# Altium project CM4_Home_Controller.PrjPcb (part 2 of 2)

## Sheet USB.SchDoc
size A4; SheetNumber: 6; SheetTotal: 10
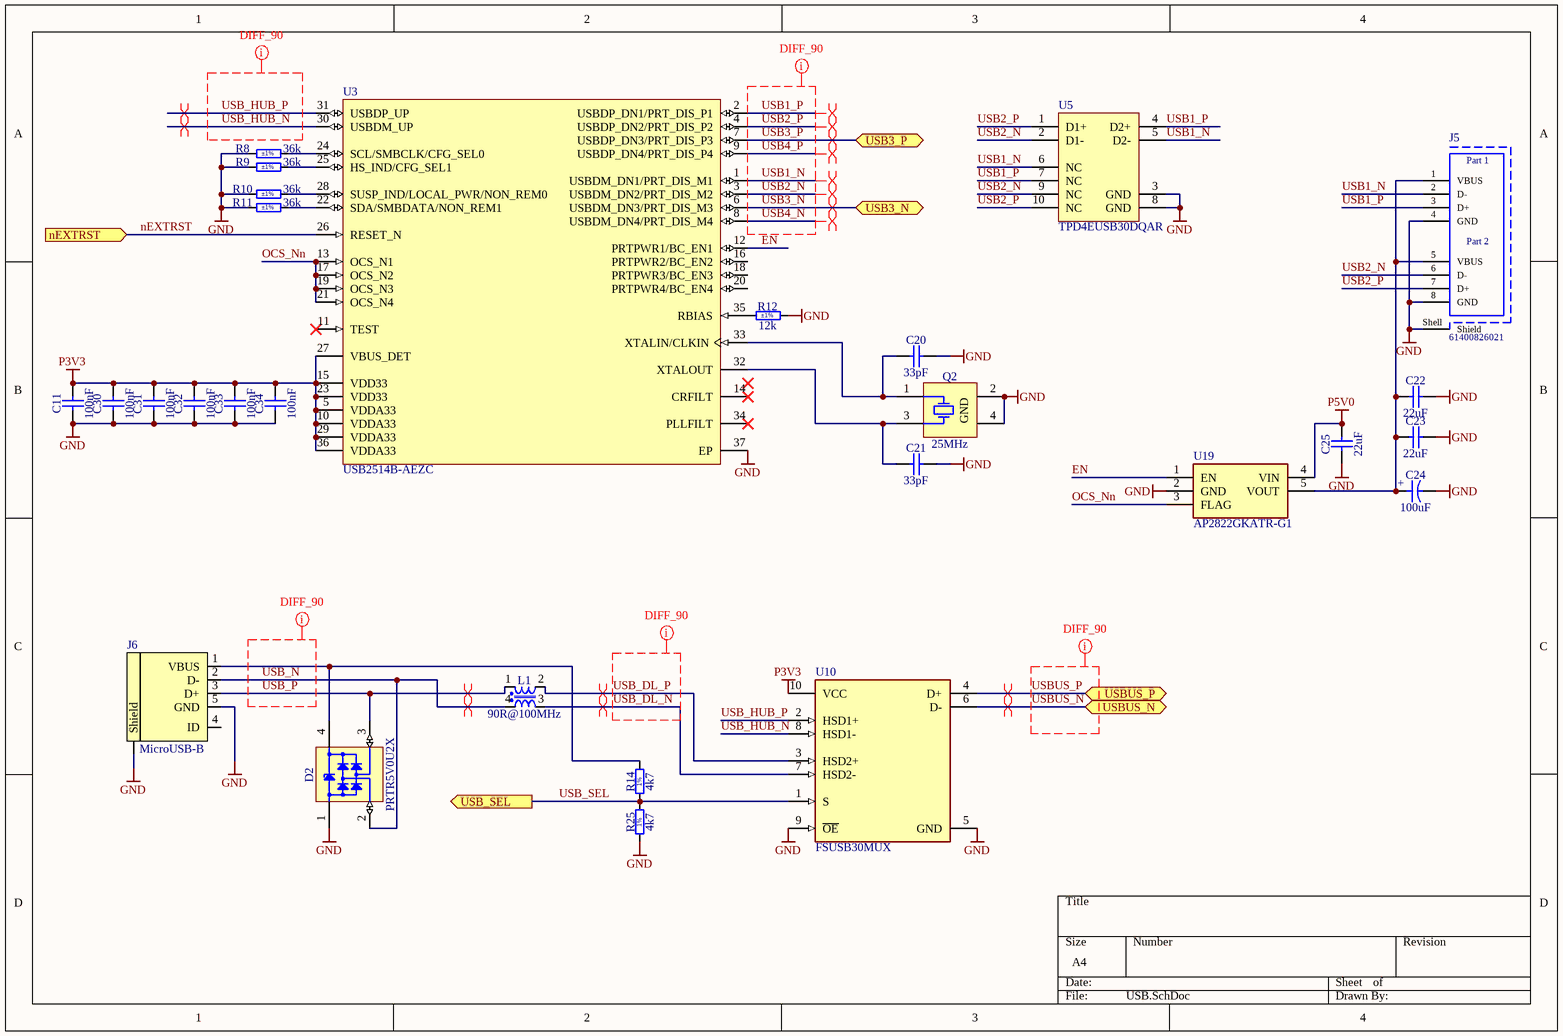
[diagram p5: USB.SchDoc]

### Parts
C11  100nF  [CAPC1005X55N]
C20  33pF  [CAPC1005X55N]
C21  33pF  [CAPC1005X55N]
C22  22uF  [CAPC2012X135N]
C23  22uF  [CAPC2012X135N]
C24  100uF  [CAPMP3216X180N]
C25  22uF  [CAPC2012X135N]
C30  100nF  [CAPC1005X55N]
C31  100nF  [CAPC1005X55N]
C32  100nF  [CAPC1005X55N]
C33  100nF  [CAPC1005X55N]
C34  100nF  [CAPC1005X55N]
D2  PRTR5V0U2X  [SOT190P230X110-4N]
J5  61400826021  [61400826021]
J6  MicroUSB-B  [USB-Micro-B-RA-SMD-PiP]
L1  90R@100MHz  [IND_MURATA_DLW21S]
Q2  25MHz  [XTAL_EPSON_TSX-3225]
R8  36k  Tolerance: ±1%  [RESC1005X40N]
R9  36k  Tolerance: ±1%  [RESC1005X40N]
R10  36k  Tolerance: ±1%  [RESC1005X40N]
R11  36k  Tolerance: ±1%  [RESC1005X40N]
R12  12k  Tolerance: ±1%  [RESC1005X40N]
R14  4k7  [RESC1005X40N]
R25  4k7  [RESC1005X40N]
U3  USB2514B-AEZC  [MCHP-QFN-36_V]
U5  TPD4EUSB30DQAR  [DQA0010A_V]
U10  FSUSB30MUX  [FP-846AP-IPC_C]
U19  AP2822GKATR-G1  [SOT95P282X145-5N]

### Ports
nEXTRST (in), USB3_N (bidir), USB3_P (bidir), USB_SEL (out), USBUS_N (bidir), USBUS_P (bidir)

### Nets
GND: C11.1 C20.2 C21.2 C22.2 C23.2 C24.2 C25.1 C30.1 C31.1 C32.1 C33.1 C34.1 D2.1(GND) J5.4(GND) J5.8(GND) J5.Shell(Shield) J6.5(GND) J6.6(Shield) Q2.2(GND) Q2.4(GND) R8.1 R9.1 R10.1 R11.1 R12.2 R25.1 U3.37(EP) U5.3(GND) U5.8(GND) U10.5(GND) U10.9(~{OE}) U19.2(GND)
P3V3: C11.2 C30.2 C31.2 C32.2 C33.2 C34.2 U3.5(VDDA33) U3.10(VDDA33) U3.15(VDD33) U3.23(VDD33) U3.27(VBUS_DET) U3.29(VDDA33) U3.36(VDDA33) U10.10(VCC)
P5V0: C25.2 U19.4(VIN)
EN: U3.12(PRTPWR1/BC_EN1) U19.1(EN)
nEXTRST: U3.26(RESET_N) ; port nEXTRST
OCS_Nn: U3.13(OCS_N1) U3.17(OCS_N2) U3.19(OCS_N3) U3.21(OCS_N4) U19.3(FLAG)
USB1_N: J5.2(D-) U3.1(USBDM_DN1/PRT_DIS_M1) U5.5(D2-) U5.6(NC)
USB1_P: J5.3(D+) U3.2(USBDP_DN1/PRT_DIS_P1) U5.4(D2+) U5.7(NC)
USB2_N: J5.6(D-) U3.3(USBDM_DN2/PRT_DIS_M2) U5.2(D1-) U5.9(NC)
USB2_P: J5.7(D+) U3.4(USBDP_DN2/PRT_DIS_P2) U5.1(D1+) U5.10(NC)
USB3_N: U3.6(USBDM_DN3/PRT_DIS_M3) ; port USB3_N
USB3_P: U3.7(USBDP_DN3/PRT_DIS_P3) ; port USB3_P
USB4_N: U3.8(USBDM_DN4/PRT_DIS_M4)
USB4_P: U3.9(USBDP_DN4/PRT_DIS_P4)
USB_DL_N: L1.3 U10.7(HSD2-)
USB_DL_P: L1.2 U10.3(HSD2+)
USB_HUB_N: U3.30(USBDM_UP) U10.8(HSD1-)
USB_HUB_P: U3.31(USBDP_UP) U10.2(HSD1+)
USB_N: D2.2(I/O1) J6.2(D-) L1.4
USB_P: D2.3(I/O2) J6.3(D+) L1.1
USB_SEL: R14.1 R25.2 U10.1(S) ; port USB_SEL
USBUS_N: U10.6(D-) ; port USBUS_N
USBUS_P: U10.4(D+) ; port USBUS_P
NetC20_1: C20.1 Q2.1(X) U3.33(XTALIN/CLKIN)
NetC21_1: C21.1 Q2.3(X) U3.32(XTALOUT)
NetC22_1: C22.1 C23.1 C24.1 J5.1(VBUS) J5.5(VBUS) U19.5(VOUT)
NetD2_4: D2.4(VCC) J6.1(VBUS) R14.2
NetR8_2: R8.2 U3.24(SCL/SMBCLK/CFG_SEL0)
NetR9_2: R9.2 U3.25(HS_IND/CFG_SEL1)
NetR10_2: R10.2 U3.28(SUSP_IND/LOCAL_PWR/NON_REM0)
NetR11_2: R11.2 U3.22(SDA/SMBDATA/NON_REM1)
NetR12_1: R12.1 U3.35(RBIAS)

Not connected (* = marked no-connect by the designer): J6 4(ID); U3 11(TEST)* 14(CRFILT)* 16(PRTPWR2/BC_EN2) 18(PRTPWR3/BC_EN3) 20(PRTPWR4/BC_EN4) 34(PLLFILT)*

### Layout directives
differential pair: USB1_N, USB1_P, USB2_N, USB2_P, USB3_N, USB3_P, USB4_N, USB4_P, USB_DL_N, USB_DL_P, USB_HUB_N, USB_HUB_P, USB_N, USB_P, USBUS_N, USBUS_P
net class DIFF_90: USB1_N, USB1_P, USB2_N, USB2_P, USB3_N, USB3_P, USB4_N, USB4_P, USB_DL_N, USB_DL_P, USB_HUB_N, USB_HUB_P, USB_N, USB_P, USBUS_N, USBUS_P

### Notes on the sheet
- (in symbol CMP-1502-03229-1) Part 1; Part 2
- (in symbol CTE3216-18_100UF_6.3V_20%_ESR0500_AVX_TLJ) +
- (in symbol R0402_4K7_1%_0.0625W_100PPM) 1%

### Library data of the parts
C11 C30-C34 = CC0402_100NF_16V_10%_X5R: Non-polarised capacitor; Part Description: SMD Multilayer Chip Ceramic Capacitor; Manufacturer: GENERIC; Manufacturer1 Part Number: GRM155R61C104KA88D; Voltage: 16V; TC: X5R; Tolerance: ±10%; Part Number: CC0402_100NF_16V_10%_X5R; Component Kind: Standard; Component Type: Standard; Pin Count: 2; Value: 100nF; Status: None; Manufacturer Part Number: CC0402_100NF_16V_10%_X5R; Case: 0402; Mounted: Yes; Socket: No; SMD: Yes; Sense: No; Manufacturer1 Example: MURATA; Manufacturer1 ComponentHeight: 0.55mm; HelpURL: \\cern.ch\dfs\Applications\Altium\Datasheets\CC0402_X5R_MURATA_GRM.pdf; Author: CERN DEM JLC; CreateDate: 10.12.2013; LatestRevisionDate: 10.12.2013
C20 C21 = CC0402_33PF_50V_5%_C0G: Non-polarised capacitor; Part Description: SMD Multilayer Chip Ceramic Capacitor; Manufacturer: GENERIC; Manufacturer1 Part Number: C0402C330J5GACTU; Voltage: 50V; TC: C0G/NP0; Tolerance: ±5%; Part Number: CC0402_33PF_50V_5%_C0G; Component Kind: Standard; Component Type: Standard; Pin Count: 2; Value: 33pF; Status: Preferred; Manufacturer Part Number: CC0402_33PF_50V_5%_C0G; Case: 0402; Mounted: Yes; Socket: No; SMD: Yes; Sense: No; Manufacturer1 Example: KEMET; Manufacturer1 ComponentHeight: 0.55mm; HelpURL: \\cern.ch\dfs\Applications\Altium\Datasheets\CC0805_C0G_KEMET_(Commercial Grade).pdf; Author: CERN DEM JLC; CreateDate: 03.12.2007; LatestRevisionDate: 22.04.2015
C22 C23 C25 = CC0805_22UF_10V_+80%-20%_Y5V: Non-polarised capacitor; Part Description: SMD Multilayer Chip Ceramic Capacitor; Manufacturer: GENERIC; Manufacturer1 Part Number: 2222 241 19881; Voltage: 10V; TC: Y5V; Part Number: CC0805_22UF_10V_+80%-20%_Y5V; Component Kind: Standard; Component Type: Standard; Pin Count: 2; Value: 22uF; Status: Preferred; Tolerance: +80% -20%; Manufacturer Part Number: CC0805_22UF_10V_+80%-20%_Y5V; Case: 0805; Mounted: Yes; Socket: No; SMD: Yes; Sense: No; Manufacturer1 Example: PHYCOMP; Manufacturer1 ComponentHeight: 1.45mm; HelpURL: \\cern.ch\dfs\Applications\Altium\Datasheets\CC0805_Y5V_PHYCOMP.pdf; Author: CERN DEM JLC; CreateDate: 03.12.2007; LatestRevisionDate: 03.12.2007
C24 = CTE3216-18_100UF_6.3V_20%_ESR0500_AVX_TLJ: Polarised capacitor; Part Description: ESR 0R5 Solid Tantalum Chip Capacitor; Manufacturer: AVX; Manufacturer Part Number: TLJA107M006R0500; Voltage: 6.3V; Tolerance: ±20%; Part Number: CTE3216-18_100UF_6.3V_20%_ESR0500_AVX_TLJ; Component Kind: Standard; Component Type: Standard; Pin Count: 2; Value: 100uF; Status: None; Case: A; Mounted: Yes; Socket: No; SMD: Yes; Sense: No; ComponentHeight: 1.8mm; HelpURL: \\cern.ch\dfs\Applications\Altium\Datasheets\CTE_AVX_TLJ.pdf; Author: CERN DEM JLC; CreateDate: 19.12.2013; LatestRevisionDate: 19.12.2013
D2 = PRTR5V0U2X: Ultra Low Capacitance Double Rail-to-Rail ESD Protection Diode; Part Description: Ultra Low Capacitance (1pF) Double Rail-to-Rail ESD Protection Diode (8kV); Manufacturer: NXP SEMICONDUCTORS; Voltage: 5.5V; PressFit: No; Bonding: No; Part Number: PRTR5V0U2X; Component Kind: Standard; Component Type: Standard; Device: PRTR5V0U2X; PackageDescription: SOT143B, SOT, 1.90mm Pitch; 4 Pin, 1.30mm W X 2.90mm L X 1.10mm H body, IPC Medium Density; Manufacturer Part Number: PRTR5V0U2X; Pin Count: 4; Case: SOT143B; Mounted: Yes; Socket: No; SMD: Yes; Sense: No; ComponentHeight: 1.1mm; HelpURL: \\cern.ch\dfs\Applications\Altium\Datasheets\PRTR5V0U2X.pdf; Author: CERN DEM JLC; CreateDate: 22.03.2011; LatestRevisionDate: 22.03.2011
J5 = CMP-1502-03229-1: USB 2.0 Type A Receptacle WR-COM, Stacked Horizontal, THT; Manufacturer: Wurth Elektronik; Contact Resistance: 20mOhm; Rated Current: 1.5A; Working Voltage: 30VAC; Connector Type: USB2.0TypeA; Packaging: Tray; Package Reference: 61400826021; Mounting Technology: THT; Datasheet URL: https://katalog.we-online.de/em/datasheet/61400826021.pdf; Operating Temperature: -40to105degC; Gender: Receptacle; Orientation: StackedHorizontal; Part Number: 61400826021; Publisher: WurthElektronik; Manufacturer URL: http://www.we-online.de
J6 = MiniUSB-AB-SMT: MicroUSB-B-SMT; Manufacturer: Allen Creations Corp.; Manufacturer Part Number: AJU55-BS2111-L; 2nd source part number: 609-4616-1-ND; Artikkelnr Noca: 55029020; Artikkelnr Simpro: N.A.; Part Number: USB-Micro-B-RA-SMD-PiP; Datasheet: \\hizz\pro\app9717\Datasheet\connectores\Allen Creations Corp\AJU-211.pdf; Footprint Doc: USB-Micro-B-RA-SMD-PiP; LatestRevisionDate: 2016-04-21; Pin Count: 5; Publisher: Nordic Semiconductor; Published: 2014-10-07; Value: MicroUSB-B; Note: *; Supplier: Cabcon; Supplier part number: AJU55-BS2111-L; 2nd source Supplier: Digi-Key
L1 = IND_MURATA_DLW21SN900SQ2L: Inductor Common Mode; Part Description: Wire Wound Common Mode Choke Coil (DLW21S Series); Manufacturer: MURATA; Power: 330mA; Resistance: 0.35R; Tolerance: ±25%; Part Number: IND_MURATA_DLW21SN900SQ2L; Component Kind: Standard; Component Type: Standard; Pin Count: 4; Value: 90R@100MHz; Status: None; Manufacturer Part Number: DLW21SN900SQ2L; Case: 0805; Mounted: Yes; Socket: No; SMD: Yes; Sense: No; ComponentHeight: 1.4mm; HelpURL: \\cern.ch\dfs\Applications\Altium\Datasheets\IND_MURATA_DLW21S.pdf; Author: CERN DEM JLC; CreateDate: 01.07.2014; LatestRevisionDate: 01.07.2014
Q2 = XTAL_25MHZ_EPSON_TSX-3225 25.0000MF10Z-AC: Crystal 4 pins 1=XTAL Control 2=GND3=XTAL 4=GND; Part Description: Tolerance ±10 ppm,  Stability:± 10ppm, -20°C to 75°C, 9pF, Surface Mount Quartz Crystal, TX-3225 Series; Manufacturer: EPSON; PressFit: No; Bonding: No; Part Number: XTAL_25MHZ_EPSON_TSX-3225 25.0000MF10Z-AC; Component Kind: Standard; Component Type: Standard; PackageDescription: Crystal TSX-3225 Serie, Corner Concave; 4 pin, 2.50mm L X 3.2mm W X 0.6mm H; Value: 25MHz; Manufacturer Part Number: TSX-3225 25.0000MF10Z-AC; Pin Count: 4; Mounted: Yes; Socket: No; SMD: Yes; Sense: No; ComponentHeight: 0.6mm; HelpURL: \\cern.ch\dfs\Applications\Altium\Datasheets\XTAL_EPSON_TSX-3225.pdf; ComponentLink1URL: \\cern.ch\dfs\Applications\Altium\Datasheets\XTAL_EPSON_TSX-3225_Ordering-Informations.pdf; ComponentLink1Description: Ordering Informations; Author: CERN DEM JLC; CreateDate: 03.04.2012; LatestRevisionDate: 06.10.2016
R8-R11 = R0402_36K_1%_0.0625W_100PPM: Resistor - 1%; Part Description: General Purpose Thick Film Chip Resistor; Manufacturer: GENERIC; Manufacturer1 Part Number: 232270673603L; TC: ±100ppm/°C; PressFit: No; Part Number: R0402_36K_1%_0.0625W_100PPM; Component Kind: Standard; Component Type: Standard; Pin Count: 2; Value: 36k; Status: Not Recommended; Power: 0.0625W; Manufacturer Part Number: R0402_36K_1%_0.0625W_100PPM; Case: 0402; Mounted: Yes; Sense: No; Socket: No; SMD: Yes; Manufacturer1 Example: YAGEO PHYCOMP; Manufacturer1 ComponentHeight: 0.4mm; HelpURL: \\cern.ch\dfs\Applications\Altium\Datasheets\R0402_Phycomp_RC0402.pdf; Author: CERN DEM JLC; CreateDate: 03.12.2007; LatestRevisionDate: 17.10.2012
R12 = R0402_12K_1%_0.0625W_100PPM: Resistor - 1%; Part Description: General Purpose Thick Film Chip Resistor; Manufacturer: GENERIC; Manufacturer1 Part Number: 232270671203L; TC: ±100ppm/°C; PressFit: No; Part Number: R0402_12K_1%_0.0625W_100PPM; Component Kind: Standard; Component Type: Standard; Pin Count: 2; Value: 12k; Status: Not Recommended; Power: 0.0625W; Manufacturer Part Number: R0402_12K_1%_0.0625W_100PPM; Case: 0402; Mounted: Yes; Sense: No; Socket: No; SMD: Yes; Manufacturer1 Example: YAGEO PHYCOMP; Manufacturer1 ComponentHeight: 0.4mm; HelpURL: \\cern.ch\dfs\Applications\Altium\Datasheets\R0402_Phycomp_RC0402.pdf; Author: CERN DEM JLC; CreateDate: 03.12.2007; LatestRevisionDate: 17.10.2012
R14 R25 = R0402_4K7_1%_0.0625W_100PPM: Resistor - 1%; Part Description: General Purpose Thick Film Chip Resistor; Manufacturer: GENERIC; Manufacturer1 Part Number: 232270674702L; TC: ±100ppm/°C; PressFit: No; Part Number: R0402_4K7_1%_0.0625W_100PPM; Component Kind: Standard; Component Type: Standard; Pin Count: 2; Value: 4k7; Status: Not Recommended; Power: 0.0625W; Tolerance: ±1%; Manufacturer Part Number: R0402_4K7_1%_0.0625W_100PPM; Case: 0402; Mounted: Yes; Sense: No; Socket: No; SMD: Yes; Manufacturer1 Example: YAGEO PHYCOMP; Manufacturer1 ComponentHeight: 0.4mm; HelpURL: \\cern.ch\dfs\Applications\Altium\Datasheets\R0402_Phycomp_RC0402.pdf; Author: CERN DEM JLC; CreateDate: 03.12.2007; LatestRevisionDate: 17.10.2012
U3 = CMP-2000-05217-1: USB 2.0 High-Speed Hub Controller, 4 Ports, 3 to 3.6 V, 0 to 85 degC, 36-Pin QFN, RoHS, Tray; Manufacturer: Microchip; Interface: I²CEEPROM,SMBus(2-Wire,I²C); Other Names: 638-1122; Voltage - Supply: 3V~3.6V; Current - Supply: 70mA; Manufacturer URL: http://www.microchip.com/; Packaging: Tray; Function: -; Standards: -; Category: IntegratedCircuits(ICs); Package / Case: 36-VFQFNExposedPad; Supplier Device Package: 36-QFN(6x6); Family: Interface-Controllers; Datasheet Version: DS00001692C, 10/2015; Standard Package: 490; Series: -; Protocol: -; Datasheet URL: http://ww1.microchip.com/downloads/en/DeviceDoc/00001692C.pdf; Operating Temperature: -
U5 = CMP-0326-00027-3: ESD Solution for Super-Speed (6 GBPS) USB 3.0 Interface, 4 Channels, -40 to +85 degC, 10-pin SON (DQA), Green (RoHS & no Sb/Br); Manufacturer: Texas Instruments; Differential Capacitance(pF): 0.05; Serial ATA / eSATA: TRUE; IO Capacitance(Typ)(pF): 0.8; IO Leakage Current(nA): 10; IEC 61000-4-2 Air-Gap(+/- kV): 8; ComponentLink3Description: URL Link1; PartNumber: TPD4EUSB30DQAR; DatasheetVersion: SLVSAC2C; ComponentLink2URL: http://www.ti.com/general/docs/lit/getliterature.tsp?genericPartNumber=TPD4EUSB30&fileType=pdf; USB Super Speed: TRUE; Eco-Plan: Green (RoHS & no Sb/Br); Mounting Technology: Surface Mount; 1394 / Firewire: TRUE; PackageVersion: revB, Sep-2009; SubFamily: ESD Solution; USB Full Speed: TRUE; USB High Speed: TRUE; ComponentLink2Description: Datasheet; ComponentLink1URL: http://www.ti.com/; IEC 61000-4-2 Contact(+/- kV): 8; Breakdown Voltage(Min)(V): 8; PackageReference: DQA0010A; ComponentLink1Description: Manufacturer URL; PackageDescription: 10-Pin Plastic Small Outline No-Lead, 1 x 2.5 x 0.55 mm Body, 0.5 mm Pitch; ComponentLink3URL: SamplesURL:http://www.ti.com/product/tpd4eusb30#samples; HDMI: TRUE
U10 = CMP-07103-000007-1: IC USB SWITCH 2X2 10MSOP; On-State Resistance: 10R; Data Rate: 480Mbps; Max Supply Voltage: 4.3V; Supply Type: Single; Turn-Off Delay Time: 4ns; Bandwidth: 750MHz; Number of Outputs: 4; Propagation Delay: 0.25ns; Turn-On Delay Time: 7ns; USB Standard: USB 2.0; Throw Configuration: DPST; Number of Ports: 2; Drain to Source Resistance: 4.5R; Number of Channels: 1; Min Supply Voltage: 3V; Lead Free: Lead Free; Termination: SMD/SMT; Package Quantity: 1; Number of Pins: 10; REACH SVHC: No SVHC; Radiation Hardening: No; Packaging: Tape and Reel; Weight: 0.1125g; Height: 1.1mm; Min Operating Temperature: -40°C; Max Operating Temperature: 85°C; Case/Package: MSOP; Width: 3mm; Length: 3mm; Number of Inputs: 2; Mount: Surface Mount
U19 = AP2822GKATR-G1: Switch; Manufacturer_Name: Diodes Inc.; Datasheet Link: https://www.arrow.com/en/products/ap2822gkatr-g1/diodes-incorporated; Height: 1.45mm; Manufacturer_Part_Number: AP2822GKATR-G1

## Sheet HDMI_DP.SchDoc
size A4; SheetNumber: 7; SheetTotal: 10
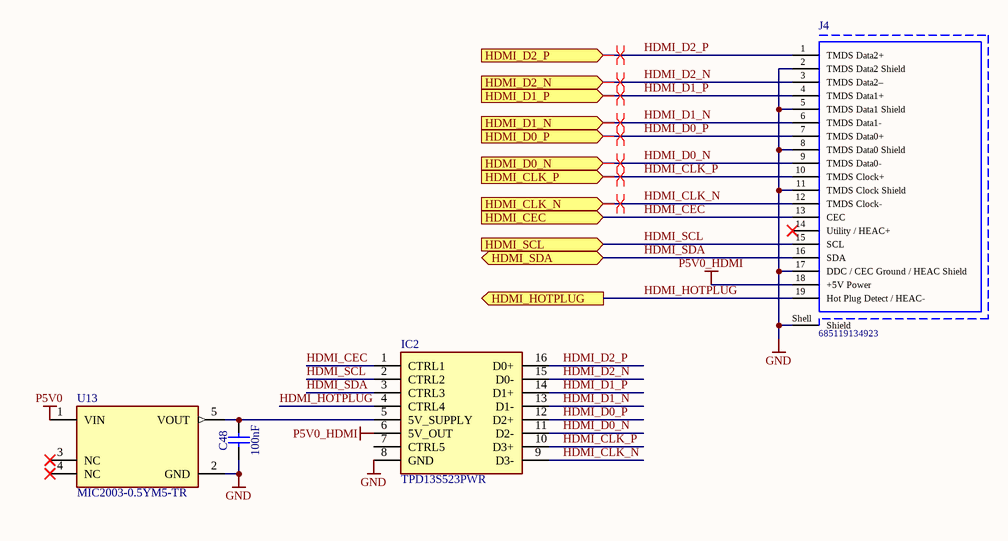
[diagram p6: HDMI_DP.SchDoc]

### Parts
C48  100nF  [CAPC1005X55N]
IC2  TPD13S523PWR  [SOP65P640X120-16N]
J4  685119134923  [685119134923]
U13  MIC2003-0.5YM5-TR  [FP-SOT23-5LD-PL-1-IPC_A]

### Ports
HDMI_CEC (in), HDMI_CLK_N (in), HDMI_CLK_P (in), HDMI_D0_N (in), HDMI_D0_P (in), HDMI_D1_N (in), HDMI_D1_P (in), HDMI_D2_N (in), HDMI_D2_P (in), HDMI_HOTPLUG (out), HDMI_SCL (in), HDMI_SDA (bidir)

### Nets
GND: C48.1 IC2.8(GND) J4.2(TMDS_Data2_Shield) J4.5(TMDS_Data1_Shield) J4.8(TMDS_Data0_Shield) J4.11(TMDS_Clock_Shield) J4.17(DDC_/_CEC_Ground_/_HEAC_Shield) J4.Shell(Shield) U13.2(GND)
P5V0: U13.1(VIN)
P5V0_HDMI: IC2.6(5V_OUT) J4.18(+5V_Power)
HDMI_CEC: IC2.1(CTRL1) J4.13(CEC) ; port HDMI_CEC
HDMI_CLK_N: IC2.9(D3-) J4.12(TMDS_Clock-) ; port HDMI_CLK_N
HDMI_CLK_P: IC2.10(D3+) J4.10(TMDS_Clock+) ; port HDMI_CLK_P
HDMI_D0_N: IC2.11(D2-) J4.9(TMDS_Data0-) ; port HDMI_D0_N
HDMI_D0_P: IC2.12(D2+) J4.7(TMDS_Data0+) ; port HDMI_D0_P
HDMI_D1_N: IC2.13(D1-) J4.6(TMDS_Data1-) ; port HDMI_D1_N
HDMI_D1_P: IC2.14(D1+) J4.4(TMDS_Data1+) ; port HDMI_D1_P
HDMI_D2_N: IC2.15(D0-) J4.3(TMDS_Data2–) ; port HDMI_D2_N
HDMI_D2_P: IC2.16(D0+) J4.1(TMDS_Data2+) ; port HDMI_D2_P
HDMI_HOTPLUG: IC2.4(CTRL4) J4.19(Hot_Plug_Detect_/_HEAC-) ; port HDMI_HOTPLUG
HDMI_SCL: IC2.2(CTRL2) J4.15(SCL) ; port HDMI_SCL
HDMI_SDA: IC2.3(CTRL3) J4.16(SDA) ; port HDMI_SDA
NetC48_2: C48.2 IC2.5(5V_SUPPLY) U13.5(VOUT)

Not connected (* = marked no-connect by the designer): IC2 7(CTRL5); J4 14(Utility_/_HEAC+)*; U13 3(NC)* 4(NC)*

### Layout directives
differential pair: HDMI_CLK_N, HDMI_CLK_P, HDMI_D0_N, HDMI_D0_P, HDMI_D1_N, HDMI_D1_P, HDMI_D2_N, HDMI_D2_P

### Library data of the parts
C48 = CC0402_100NF_16V_10%_X5R: Non-polarised capacitor; Manufacturer: GENERIC; Part Description: SMD Multilayer Chip Ceramic Capacitor; Manufacturer1 Part Number: GRM155R61C104KA88D; Tolerance: ±10%; Voltage: 16V; TC: X5R; Manufacturer Part Number: CC0402_100NF_16V_10%_X5R; Part Number: CC0402_100NF_16V_10%_X5R; Value: 100nF; Component Kind: Standard; Component Type: Standard; Pin Count: 2; Status: None; Case: 0402; Mounted: Yes; Socket: No; SMD: Yes; Sense: No; Manufacturer1 Example: MURATA; Manufacturer1 ComponentHeight: 0.55mm; HelpURL: \\cern.ch\dfs\Applications\Altium\Datasheets\CC0402_X5R_MURATA_GRM.pdf; Author: CERN DEM JLC; CreateDate: 10.12.2013; LatestRevisionDate: 10.12.2013
IC2 = TPD13S523PWR: Integrated Circuit; Manufacturer_Name: Texas Instruments; Datasheet Link: http://www.ti.com/lit/gpn/tpd13s523; Height: 1.2mm; Manufacturer_Part_Number: TPD13S523PWR
J4 = CMP-1502-00169-1: HDMI Type A Receptacle WR-HDMI, Horizontal, SMT; Manufacturer: Wurth Elektronik; Contact Resistance: 30mOhm; Working Voltage: 40VDC; Rated Current: 0.5A; Publisher: WurthElektronik; Datasheet URL: https://katalog.we-online.de/em/datasheet/685119134923.pdf; Gender: Receptacle; Manufacturer URL: http://www.we-online.de; Orientation: Horizontal; Mounting Technology: SMT; Part Number: 685119134923; Packaging: TapeandReel; Package Reference: 685119134923; Operating Temperature: -20to85degC; Connector Type: HDMITypeA
U13 = CMP-06320-000017-1: IC PWR SWITCH P-CHAN 1:1 SOT23-5; Max Input Voltage: 5.5V; Output Configuration: High Side; Min Input Voltage: 2.5V; On-State Resistance: 70mR; Number of Outputs: 1; Rated Current-Max: 500mA; Fault Protection: Over Temperature; Interface: On/Off; Output Voltage: 6V; On-state Resistance-Max: 100MR; Length: 2.9mm; Width: 1.6mm; Packaging: Tape and Reel; Series: -; Number of Pins: 5; Height: 1.1mm; Max Output Current: 500mA; Lead Free: Lead Free; Max Operating Temperature: 85°C; Min Operating Temperature: -40°C; Package Quantity: 3000; Number of Switches: 1; Mount: Surface Mount; Number of Inputs: 1; Current Rating: 500mA; Case/Package: SOT-23; REACH SVHC: No SVHC; RoHS Compliant: Yes

## Sheet RTC_TEMP.SchDoc
size A4; SheetNumber: 8; SheetTotal: 10
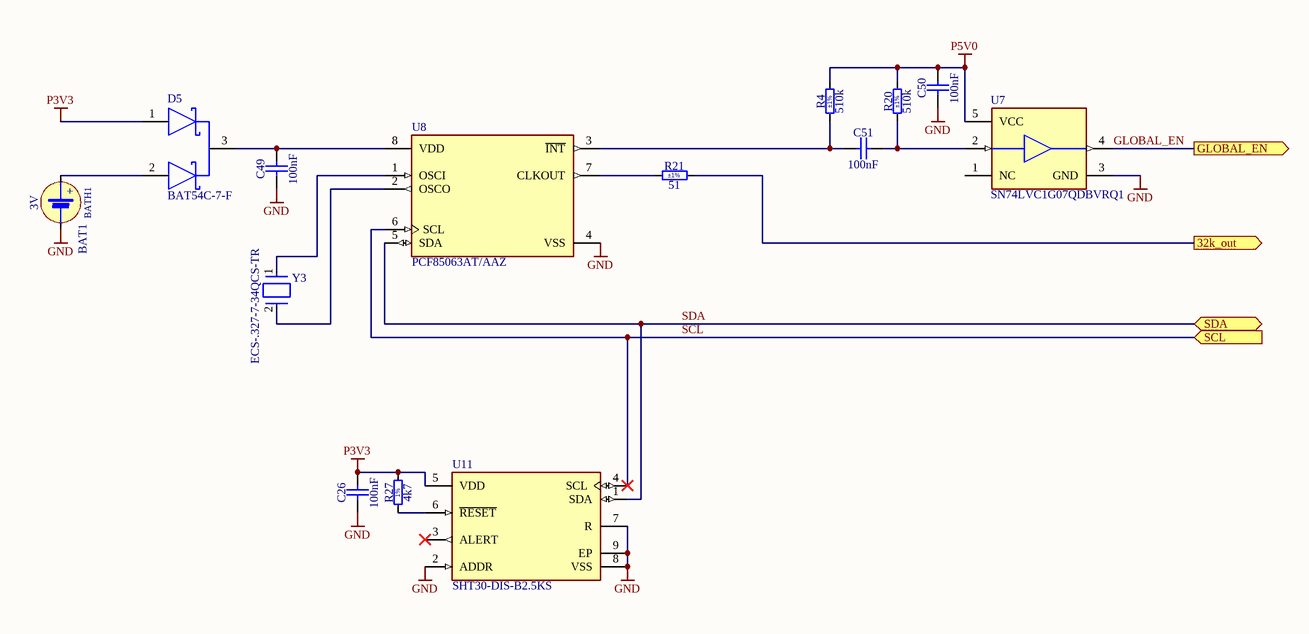
[diagram p7: RTC_TEMP.SchDoc]

### Parts
BAT1  3V  [BAT_VARTA_CR1220]
BATH1  (no value)  [BATH_KEYSTONE_3000]
C26  100nF  [CAPC1005X55N]
C49  100nF  [CAPC1005X55N]
C50  100nF  [CAPC1005X55N]
C51  100nF  [CAPC1005X55N]
D5  BAT54C-7-F  [FP-SOT23-IPC_A]
R4  510k  Tolerance: ±1%  [RESC1005X40N]
R20  510k  Tolerance: ±1%  [RESC1005X40N]
R21  51  Tolerance: ±1%  [RESC1005X40N]
R27  4k7  [RESC1005X40N]
U7  SN74LVC1G07QDBVRQ1  [FP-DBV0005A-IPC_A]
U8  PCF85063AT/AAZ  [FP-SOT96-1-MFG]
U11  SHT30-DIS-B2.5KS  [FP-SHT30-DIS-B2_5KS-MFG]
Y3  ECS-.327-7-34QCS-TR  [FP-ECX-34Q-0]

### Ports
32k_out (out), GLOBAL_EN (out), SCL (in), SDA (bidir)

### Nets
GND: BATH1.2(MINUS) C26.1 C49.1 C50.1 U7.3(GND) U8.4(VSS) U11.2(ADDR) U11.7(R) U11.8(VSS) U11.9(EP)
P3V3: C26.2 D5.1(1_ANODE) R27.2 U11.5(VDD)
P5V0: C50.2 R4.2 R20.2 U7.5(VCC)
32k768: R21.2 ; port 32k_out
GLOBAL_EN: U7.4(Y) ; port GLOBAL_EN
SCL: U8.6(SCL) U11.4(SCL) ; port SCL
SDA: U8.5(SDA) U11.1(SDA) ; port SDA
NetBATH1_1: BATH1.1(PLUS) D5.2(2_ANODE)
NetC49_2: C49.2 D5.3(COMMON_CATHODE) U8.8(VDD)
NetC51_1: C51.1 R4.1 U8.3(~{INT})
NetC51_2: C51.2 R20.1 U7.2(A)
NetR21_1: R21.1 U8.7(CLKOUT)
NetR27_1: R27.1 U11.6(~{RESET})
NetU8_1: U8.1(OSCI) Y3.1(In/Out)
NetU8_2: U8.2(OSCO) Y3.2(Out/In)

Not connected (* = marked no-connect by the designer): U7 1(NC); U11 3(ALERT)*

### Notes on the sheet
- (in symbol BAT_VARTA_CR1220) +
- (in symbol BATH_KEYSTONE_3000) +
- (in symbol R0402_4K7_1%_0.0625W_100PPM) 1%

### Library data of the parts
BAT1 = BAT_VARTA_CR1220: Battery for use only with Socket Holder; Part Description: CR1210, 12.5mm Diameter x 2mm  Height Lithium Coin Cells; Manufacturer: VARTA; Manufacturer Part Number: 6220; PressFit: No; Power: 35mAh; Part Number: BAT_VARTA_CR1220; Component Kind: Accessories; Component Type: Standard; Pin Count: 0; PackageDescription: CR1210, 12.5mm Diameter x 2mm  Height Lithium Coin Cells; Family: Battery; Mounted: Yes; Socket: Yes; SMD: No; Sense: No; Value: 3V; ComponentHeight: 2mm; HelpURL: \\cern.ch\dfs\Applications\Altium\Datasheets\BAT_VARTA_CR1220.pdf; Author: CERN DEM JLC; CreateDate: 17.04.2012; LatestRevisionDate: 17.04.2012
BATH1 = BATH_KEYSTONE_3000: Battery Holder whit 2 Pin; Part Description: SMD Battery Holder for CR1216, BR1220, CL1225, SR1120, D381, 391, 191 Coin Cells; Manufacturer Part Number: 3000; PressFit: No; Part Number: BATH_KEYSTONE_3000; Component Kind: Standard; Component Type: Standard; Pin Count: 3; PackageDescription: SMD Battery Holder for CR1216, BR1220, CL1225, SR1120, D381, 391, 191 Coin Cells; Family: Battery; Mounted: Yes; Socket: No; SMD: Yes; Sense: No; Manufacturer: KEYSTONE; ComponentHeight: 3.17mm; HelpURL: \\cern.ch\dfs\Applications\Altium\Datasheets\BATH_KEYSTONE_3000.pdf; Author: CERN DEM JLC; CreateDate: 17.04.2012; LatestRevisionDate: 07.06.2017
C26 C49-C51 = CC0402_100NF_16V_10%_X5R: as C48 on sheet HDMI_DP; Manufacturer Part Number: CC0402_100NF_16V_10%_X5R; Part Number: CC0402_100NF_16V_10%_X5R; Value: 100nF; Component Kind: Standard; Component Type: Standard; Pin Count: 2; Status: None; Case: 0402; Mounted: Yes; Socket: No; SMD: Yes; Sense: No; Manufacturer1 Example: MURATA; Manufacturer1 ComponentHeight: 0.55mm; HelpURL: \\cern.ch\dfs\Applications\Altium\Datasheets\CC0402_X5R_MURATA_GRM.pdf; Author: CERN DEM JLC; CreateDate: 10.12.2013; LatestRevisionDate: 10.12.2013
D5 = CMP-12790-000084-1: DIODE ARRAY SCHOTTKY 30V SOT23-3; Max Reverse Current: 2uA; Power Dissipation: 200mW; Average Rectified Current: 200mA; Capacitance: 10pF; Peak Non-Repetitive Surge Current: 600mA; Forward Voltage: 800mV; Reverse Recovery Time: 5ns; Element Configuration: Common Cathode; Max Operating Temperature: 150°C; Max Reverse Voltage (DC): 30V; Power Rating: 200mW; Termination: SMD/SMT; REACH SVHC: No SVHC; Voltage Rating (DC): 30V; Series: -; Current Rating: 200mA; RoHS Compliant: Yes; Max Power Dissipation: 200mW; Case/Package: SOT-23; Max Repetitive Reverse Voltage (Vrrm): 30V; Width: 1.3mm; Min Operating Temperature: -65°C; Lead Free: Lead Free; Forward Current: 200mA; Number of Pins: 3; Contact Plating: Tin; Package Quantity: 3000; Length: 2.9mm; Radiation Hardening: No; Max Forward Surge Current (Ifsm): 600mA; Height: 1mm; Packaging: Tape and Reel; Mount: Surface Mount; Weight: 0.000282oz
R4 R20 = R0402_510K_1%_0.0625W_100PPM: Resistor - 1%; Part Description: General Purpose Thick Film Chip Resistor; Manufacturer: GENERIC; Manufacturer1 Part Number: 232270675104L; TC: ±100ppm/°C; PressFit: No; Part Number: R0402_510K_1%_0.0625W_100PPM; Component Kind: Standard; Component Type: Standard; Pin Count: 2; Value: 510k; Status: Not Recommended; Power: 0.0625W; Manufacturer Part Number: R0402_510K_1%_0.0625W_100PPM; Case: 0402; Mounted: Yes; Sense: No; Socket: No; SMD: Yes; Manufacturer1 Example: YAGEO PHYCOMP; Manufacturer1 ComponentHeight: 0.4mm; HelpURL: \\cern.ch\dfs\Applications\Altium\Datasheets\R0402_Phycomp_RC0402.pdf; Author: CERN DEM JLC; CreateDate: 03.12.2007; LatestRevisionDate: 17.10.2012
R21 = R0402_51R_1%_0.0625W_100PPM: Resistor - 1%; Part Description: General Purpose Thick Film Chip Resistor; Manufacturer: GENERIC; Manufacturer1 Part Number: 232270675109L; TC: ±100ppm/°C; PressFit: No; Part Number: R0402_51R_1%_0.0625W_100PPM; Component Kind: Standard; Component Type: Standard; Pin Count: 2; Value: 51; Status: Not Recommended; Power: 0.0625W; Manufacturer Part Number: R0402_51R_1%_0.0625W_100PPM; Case: 0402; Mounted: Yes; Sense: No; Socket: No; SMD: Yes; Manufacturer1 Example: YAGEO PHYCOMP; Manufacturer1 ComponentHeight: 0.4mm; HelpURL: \\cern.ch\dfs\Applications\Altium\Datasheets\R0402_Phycomp_RC0402.pdf; Author: CERN DEM JLC; CreateDate: 03.12.2007; LatestRevisionDate: 17.10.2012
R27 = R0402_4K7_1%_0.0625W_100PPM: as R14 on sheet USB; Part Number: R0402_4K7_1%_0.0625W_100PPM; Component Kind: Standard; Component Type: Standard; Pin Count: 2; Value: 4k7; Status: Not Recommended; Power: 0.0625W; Tolerance: ±1%; Manufacturer Part Number: R0402_4K7_1%_0.0625W_100PPM; Case: 0402; Mounted: Yes; Sense: No; Socket: No; SMD: Yes; Manufacturer1 Example: YAGEO PHYCOMP; Manufacturer1 ComponentHeight: 0.4mm; HelpURL: \\cern.ch\dfs\Applications\Altium\Datasheets\R0402_Phycomp_RC0402.pdf; Author: CERN DEM JLC; CreateDate: 03.12.2007; LatestRevisionDate: 17.10.2012
U7 = CMP-0859-00130-4: IC BUF NON-INVERT 5.5V SOT23-5; Quiescent Current: 10uA; Number of Channels: 1; Low Level Output Current: 32mA; Logic Function: Buffer; Turn-On Delay Time: 9.8ns; Polarity: Non-Inverting; Min Supply Voltage: 1.65V; Max Operating Temperature: 125°C; Number of Inputs: 1; Lead Free: Lead Free; Max Supply Voltage: 5.5V; Packaging: Tape and Reel; RoHS Compliant: Yes; Number of Pins: 5; Number of Input Lines: 1; Number of Outputs: 1; Technology: CMOS; Number of Bits: 1; Number of Gates: 1; Case/Package: SOT-23-5; Propagation Delay: 9.8ns; Series: 74LVC; Number of Elements: 1; Package Quantity: 3000; Number of Bits per Element: 1; Mount: Surface Mount; Number of Output Lines: 1; Min Operating Temperature: -40°C
U8 = CMP-10083-000015-1: IC RTC CLK/CALENDAR I2C 8SOIC; Date Format: YY-MM-DD-dd; Time Format: HH:MM:SS (12/24 hr); RoHS Compliant: Yes; Interface: I2C; Mount: Surface Mount; Min Operating Temperature: -40°C; Lead Free: Lead Free; Packaging: Tape and Reel; Max Operating Temperature: 85°C; Case/Package: SOIC
U11 = CMP-144040-000006-1: SENSOR HUMID/TEMP 5V I2C 3% SMD
Y3 = CMP-40224-000009-1: CRYSTAL 32.768KHZ 7PF SMD; Manufacturer: ECS Inc.; Tolerance: 10ppm; Automotive Grade: Grade 1; Esr: 70kΩ; Height: 0.9mm; Automotive: Yes; Lead Free: Yes; Temperature Range Low: -40°C; Load Capacitance: 7pF; Series: ECX-34Q; Temperature Range High: +125°C; Device Class L3: Crystals; Temperature: -40°C to +125°C; RoHS: TRUE; Category: Crys; ComponentLink2Description: Datasheet; Package: ECX-34Q; Frequency: 32.768kHz; Octopart: https://octopart.com/ecs-.327-7-34qcs-tr-ecs+international-74206377; Device Class L2: Crystals / Oscillators; Manufacturer Part Number: ECS-.327-7-34QCS-TR; Digikey Description: CRYSTAL 32.768KHZ 7PF SMD; Device Class L1: Passive Components; ComponentLink2URL: https://ecsxtal.com/store/pdf/ECX-34Q.pdf

## Sheet ZIGBEE.SchDoc
size A4; SheetNumber: 9; SheetTotal: 10
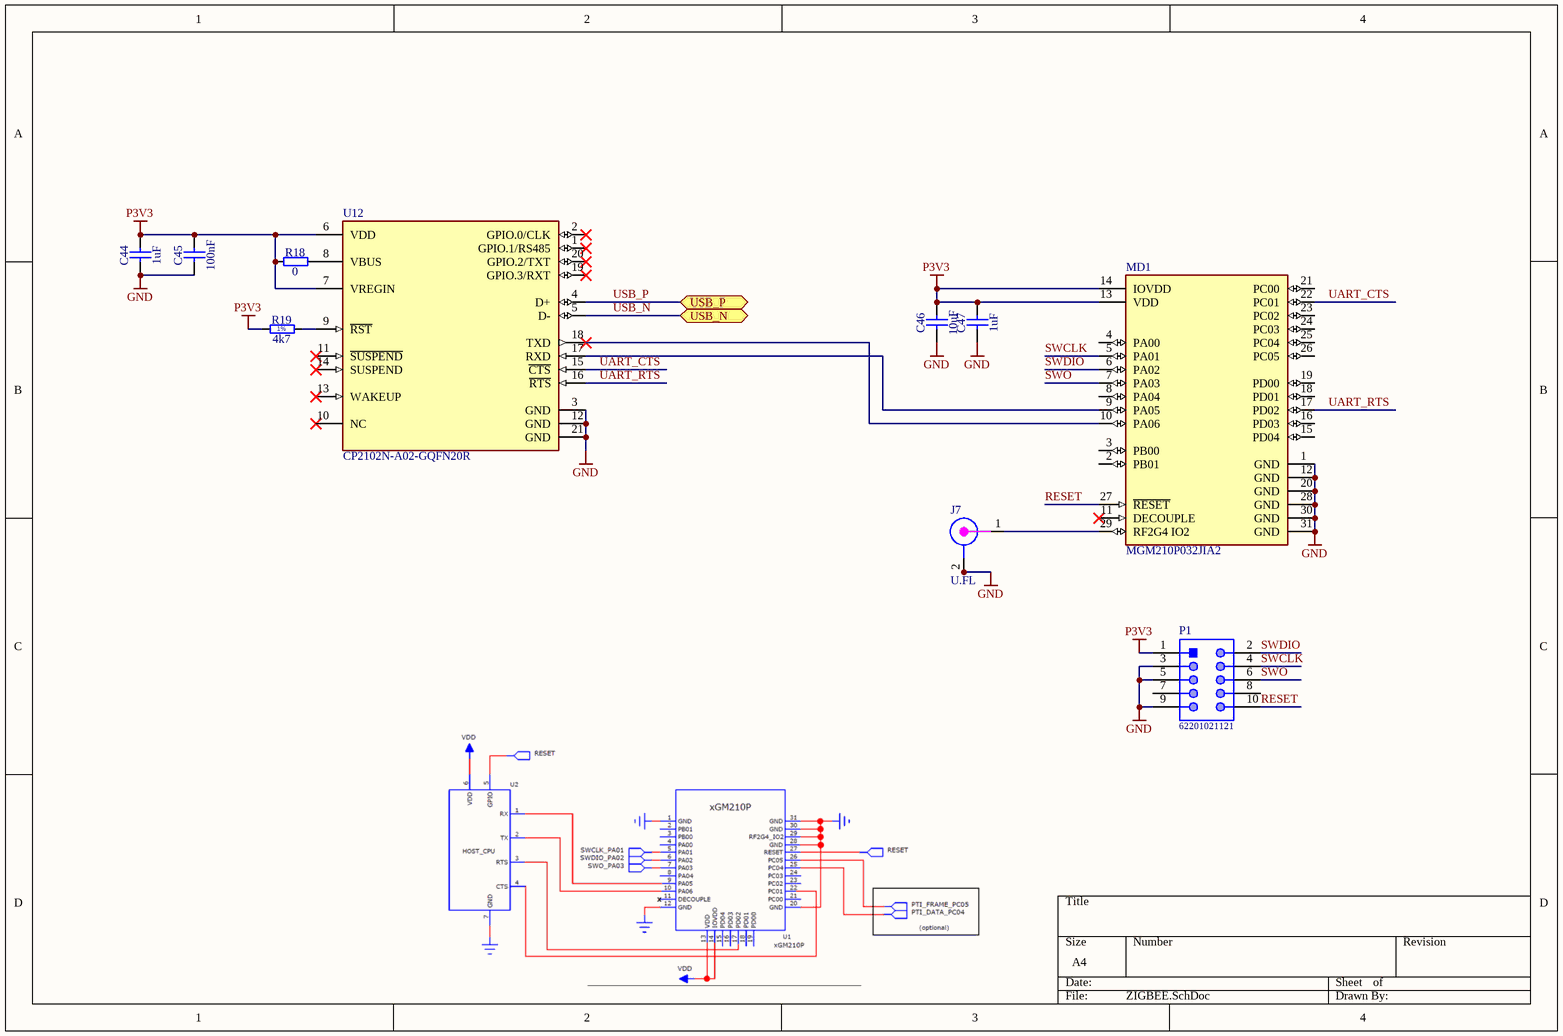
[diagram p8: ZIGBEE.SchDoc]

### Parts
C44  1uF  [CAPC1005X55N]
C45  100nF  [CAPC1005X55N]
C46  10uF  [CAPC2012X95N]
C47  1uF  [CAPC1005X55N]
J7  U.FL  [CON_UFL_HIROSE_RECEPTACLE]
MD1  MGM210P032JIA2  [FP-MGM210P032JIA2-MFG]
P1  62201021121  [62201021121]
R18  0  [RESC1005X40N]
R19  4k7  [RESC1005X40N]
U12  CP2102N-A02-GQFN20R  [FP-CP2102N-A02-GQFN20R-MFG]

### Ports
USB_N (bidir), USB_P (bidir)

### Nets
GND: C44.1 C45.1 C46.1 C47.1 J7.2 J7.2a(GND) MD1.1(GND) MD1.12(GND) MD1.20(GND) MD1.28(GND) MD1.30(GND) MD1.31(GND) P1.3 P1.5 P1.9 U12.3(GND) U12.12(GND) U12.21(GND)
P3V3: C44.2 C45.2 C46.2 C47.2 MD1.13(VDD) MD1.14(IOVDD) P1.1 R18.1 R19.1 U12.6(VDD) U12.7(VREGIN)
RESET: MD1.27(~{RESET}) P1.10
SWCLK: MD1.5(PA01) P1.4
SWDIO: MD1.6(PA02) P1.2
SWO: MD1.7(PA03) P1.6
UART_CTS: MD1.22(PC01) U12.15(~{CTS})
UART_RTS: MD1.17(PD02) U12.16(~{RTS})
USB_N: U12.5(D-) ; port USB_N  [project net USB3_N]
USB_P: U12.4(D+) ; port USB_P  [project net USB3_P]
NetJ7_1: J7.1 MD1.29(RF2G4_IO2)
NetMD1_9: MD1.9(PA05) U12.17(RXD)
NetMD1_10: MD1.10(PA06) U12.18(TXD)
NetR18_2: R18.2 U12.8(VBUS)
NetR19_2: R19.2 U12.9(~{RST})

Not connected (* = marked no-connect by the designer): MD1 2(PB01) 3(PB00) 4(PA00) 8(PA04) 11(DECOUPLE)* 15(PD04) 16(PD03) 18(PD01) 19(PD00) 21(PC00) 23(PC02) 24(PC03) 25(PC04) 26(PC05); P1 7 8; U12 1(GPIO.1/RS485)* 2(GPIO.0/CLK)* 10(NC)* 11(~{SUSPEND})* 13(WAKEUP)* 14(SUSPEND)* 19(GPIO.3/RXT)* 20(GPIO.2/TXT)*

### Notes on the sheet
- (in symbol R0402_4K7_1%_0.0625W_100PPM) 1%

### Library data of the parts
C44 C47 = CC0402_1UF_16V_10%_X5R: Non-polarised capacitor; Part Description: SMD Multilayer Chip Ceramic Capacitor; Manufacturer: GENERIC; Manufacturer1 Part Number: C1005X5R1C105KT; Voltage: 16V; TC: X5R; Tolerance: ±10%; Part Number: CC0402_1UF_16V_10%_X5R; Component Kind: Standard; Component Type: Standard; Pin Count: 2; Value: 1uF; Status: Preferred; Manufacturer Part Number: CC0402_1UF_16V_10%_X5R; Case: 0402; Mounted: Yes; Socket: No; SMD: Yes; Sense: No; Manufacturer1 Example: TDK; Manufacturer1 ComponentHeight: 0.55mm; HelpURL: \\cern.ch\dfs\Applications\Altium\Datasheets\CC0402_X5R_TDK_C.pdf; Author: CERN DEM JLC; CreateDate: 25.10.2012; LatestRevisionDate: 25.10.2012
C45 = CC0402_100NF_16V_10%_X5R: as C11 on sheet USB; Part Number: CC0402_100NF_16V_10%_X5R; Component Kind: Standard; Component Type: Standard; Pin Count: 2; Value: 100nF; Status: None; Manufacturer Part Number: CC0402_100NF_16V_10%_X5R; Case: 0402; Mounted: Yes; Socket: No; SMD: Yes; Sense: No; Manufacturer1 Example: MURATA; Manufacturer1 ComponentHeight: 0.55mm; HelpURL: \\cern.ch\dfs\Applications\Altium\Datasheets\CC0402_X5R_MURATA_GRM.pdf; Author: CERN DEM JLC; CreateDate: 10.12.2013; LatestRevisionDate: 10.12.2013
C46 = CC0805_10UF_25V_10%_X5R: Non-polarised capacitor; Part Description: SMD Multilayer Chip Ceramic Capacitor; Manufacturer: GENERIC; Manufacturer1 Part Number: GRM219R61E106KA12D; Voltage: 25V; TC: X5R; Tolerance: ±10%; Part Number: CC0805_10UF_25V_10%_X5R; Component Kind: Standard; Component Type: Standard; Pin Count: 2; Value: 10uF; Status: Preferred; Manufacturer Part Number: CC0805_10UF_25V_10%_X5R; Case: 0805; Mounted: Yes; Socket: No; SMD: Yes; Sense: No; Manufacturer1 Example: MURATA; Manufacturer1 ComponentHeight: 0.95mm; HelpURL: \\cern.ch\dfs\Applications\Altium\Datasheets\CC0805_X5R_MURATA_GRM.pdf; Author: CERN DEM JLC; CreateDate: 25.10.2012; LatestRevisionDate: 06.09.2016
J7 = CON_UFL_SMD: UFL; Supplier 1: Newark; Supplier Part Number 1: 50P8856
MD1 = CMP-08140-000013-1: RX TXRX MOD BLUETOOTH CHIP SMD; Manufacturer Part Number: MGM210P032JIA2 or MGM210P032JIA2; Manufacturer: Silicon Labs; Transmitting Current: 181.3mA; Max Frequency: 2483.5MHz; Data Rate: 2Mbits/s; Max Supply Voltage: 3.8V; Receiving Current: 9.4mA; Min Supply Voltage: 1.71V; Sensitivity: -103.9dBm; Bandwidth: 83.5MHz; Interface: I2C,SPI,UART,USART,IrDA,I2S,Other; Number Of Gpio: 20; ComponentLink2URL: https://www.silabs.com/documents/public/data-sheets/mgm210p-datasheet.pdf; Ambient Temperature Range High: +125°C; Octopart: https://octopart.com/mgm210p032jia2-silicon+labs-103954340; Device Class L2: RF Semiconductors and Devices; Category: UNK; Temperature: -40°C to +125°C; Ambient Temperature Range Low: -40°C; Automotive: No; Digikey Description: RX TXRX MOD BLUETOOTH CHIP SMD; Device Class L1: Integrated Circuits (ICs); RoHS: TRUE; Device Class L3: Transceivers; Package: 0; Temperature Range Low: -40°C; Lead Free: Yes; ComponentLink2Description: Datasheet; Height: 2.35mm; Temperature Range High: +125°C
P1 = CMP-1502-00948-1: THT Vertical Pin Header WR-PHD, Pitch 1.27 mm, Dual Row, 10 pins; Manufacturer: Wurth Elektronik; Rated Current: 1A; Pin Number: 10; Working Voltage: 100VAC; Contact Resistance: 20mOhm; Withstanding Voltage: 500VAC; Pitch: 1.27mm; Gender: Male; Mounting Technology: THT; Manufacturer URL: http://www.we-online.de; Package Reference: 62201021121; Row Number: Dual; Datasheet URL: https://katalog.we-online.de/em/datasheet/62201021121.pdf; Publisher: WurthElektronik; Packaging: Box; Operating Temperature: -40to105degC; Orientation: Vertical; Part Number: 62201021121
R18 = R0402_0R_JUMPER: Resistor; Part Description: 1A (0.05R Max DC Resistance) Zero Ohm Jumper; Manufacturer: GENERIC; Manufacturer1 Part Number: 232270591001L; PressFit: No; Part Number: R0402_0R_JUMPER; Component Kind: Standard; Component Type: Standard; Pin Count: 2; Value: 0; Status: Not Recommended; Manufacturer Part Number: R0402_0R_JUMPER; Case: 0402; Mounted: Yes; Sense: No; Socket: No; SMD: Yes; Manufacturer1 Example: YAGEO PHYCOMP; Manufacturer1 ComponentHeight: 0.4mm; HelpURL: \\cern.ch\dfs\Applications\Altium\Datasheets\R0402_Phycomp_RC0402.pdf; Author: CERN DEM JLC; CreateDate: 03.12.2007; LatestRevisionDate: 17.10.2012
R19 = R0402_4K7_1%_0.0625W_100PPM: as R14 on sheet USB; Part Number: R0402_4K7_1%_0.0625W_100PPM; Component Kind: Standard; Component Type: Standard; Pin Count: 2; Value: 4k7; Status: Not Recommended; Power: 0.0625W; Tolerance: ±1%; Manufacturer Part Number: R0402_4K7_1%_0.0625W_100PPM; Case: 0402; Mounted: Yes; Sense: No; Socket: No; SMD: Yes; Manufacturer1 Example: YAGEO PHYCOMP; Manufacturer1 ComponentHeight: 0.4mm; HelpURL: \\cern.ch\dfs\Applications\Altium\Datasheets\R0402_Phycomp_RC0402.pdf; Author: CERN DEM JLC; CreateDate: 03.12.2007; LatestRevisionDate: 17.10.2012
U12 = CMP-08107-000007-1: IC USB TO UART BRIDGE QFN20

## Sheet Misc.SchDoc
size A4; SheetNumber: 10; SheetTotal: 10
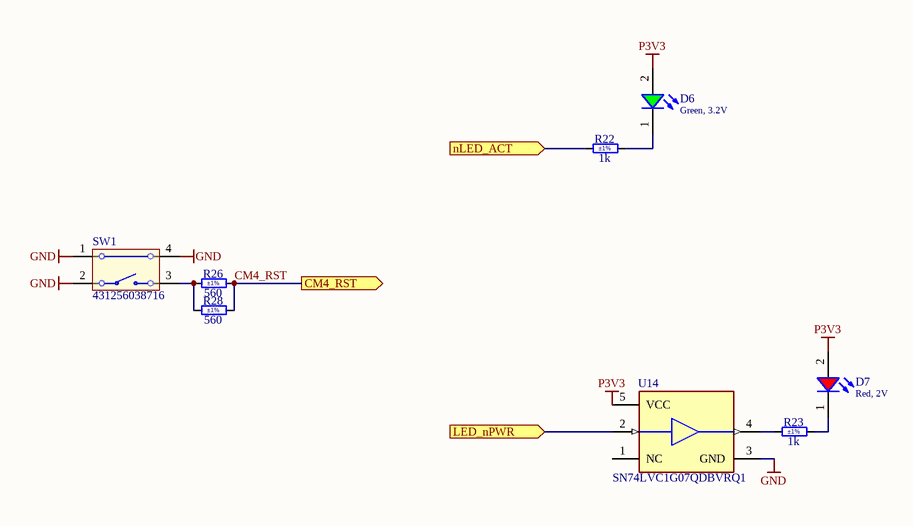
[diagram p9: Misc.SchDoc]

### Parts
D6  Green, 3.2V  [WL-SMSW_0603_Rectangular]
D7  Red, 2V  [WL-SMSW_0603_Rectangular]
R22  1k  Tolerance: ±1%  [RESC1005X40N]
R23  1k  Tolerance: ±1%  [RESC1005X40N]
R26  560  Tolerance: ±1%  [RESC1005X40N]
R28  560  Tolerance: ±1%  [RESC1005X40N]
SW1  431256038716  [431256038716]
U14  SN74LVC1G07QDBVRQ1  [FP-DBV0005A-IPC_A]

### Ports
CM4_RST (out), LED_nPWR (in), nLED_ACT (in)

### Nets
GND: SW1.1 SW1.2 SW1.4 U14.3(GND)
P3V3: D6.2(A) D7.2(A) U14.5(VCC)
CM4_RST: R26.2 R28.2 ; port CM4_RST
LED_nPWR: U14.2(A) ; port LED_nPWR
nLED_ACT: R22.1 ; port nLED_ACT
NetD6_1: D6.1(K) R22.2
NetD7_1: D7.1(K) R23.2
NetR23_1: R23.1 U14.4(Y)
NetR26_1: R26.1 R28.1 SW1.3

Not connected (* = marked no-connect by the designer): U14 1(NC)

### Library data of the parts
D6 = 155060GS75300: WL-SMSW SMT Mono-color Side View Waterclear, size 0603, Green, 3.2V, 140deg; Manufacturer: Wurth Elektronik; Chip Technology: InGaN; Dominant Wavelength typ.: 525nm; Luminous Intensity typ.: 560mcd; Peak Wavelength typ.: 515nm; Viewing Angle: 140deg; ComponentLink1Description: Manufacturer; ComponentLink1URL: http://www.we-online.de; ComponentLink2URL: https://www.we-online.com/catalog/datasheet/155060GS75300.pdf; ComponentLink2Description: Datasheet; Forward Voltage typ.: 3.2V; Emitting Color: Green; Mounting Technology: SMT; Operating Temperature: -40 to +85degC; Published Date: October 2020; Manufacturer Part Number: 155060GS75300; Packaging: Tape and Reel; Size: 0603
D7 = 155060RS75300: WL-SMSW SMT Mono-color Side View Waterclear, size 0603, Red, 2V, 140deg; Manufacturer: Wurth Elektronik; Chip Technology: AlInGaP; Dominant Wavelength typ.: 625nm; Luminous Intensity typ.: 150mcd; Peak Wavelength typ.: 630nm; Viewing Angle: 140deg; ComponentLink1Description: Manufacturer; ComponentLink1URL: http://www.we-online.de; ComponentLink2URL: https://www.we-online.com/catalog/datasheet/155060RS75300.pdf; ComponentLink2Description: Datasheet; Forward Voltage typ.: 2V; Emitting Color: Red; Mounting Technology: SMT; Operating Temperature: -40 to +85degC; Published Date: October 2020; Manufacturer Part Number: 155060RS75300; Packaging: Tape and Reel; Size: 0603
R22 R23 = R0402_1K_1%_0.0625W_100PPM: Resistor - 1%; Part Description: General Purpose Thick Film Chip Resistor; Manufacturer: GENERIC; Manufacturer1 Part Number: 232270671002L; TC: ±100ppm/°C; PressFit: No; Part Number: R0402_1K_1%_0.0625W_100PPM; Component Kind: Standard; Component Type: Standard; Pin Count: 2; Value: 1k; Status: Not Recommended; Power: 0.0625W; Manufacturer Part Number: R0402_1K_1%_0.0625W_100PPM; Case: 0402; Mounted: Yes; Sense: No; Socket: No; SMD: Yes; Manufacturer1 Example: YAGEO PHYCOMP; Manufacturer1 ComponentHeight: 0.4mm; HelpURL: \\cern.ch\dfs\Applications\Altium\Datasheets\R0402_Phycomp_RC0402.pdf; Author: CERN DEM JLC; CreateDate: 03.12.2007; LatestRevisionDate: 17.10.2012
R26 R28 = R0402_560R_1%_0.0625W_100PPM: Resistor - 1%; Part Description: General Purpose Thick Film Chip Resistor; Manufacturer: GENERIC; Manufacturer1 Part Number: 232270675601L; TC: ±100ppm/°C; PressFit: No; Part Number: R0402_560R_1%_0.0625W_100PPM; Component Kind: Standard; Component Type: Standard; Pin Count: 2; Value: 560; Status: Not Recommended; Power: 0.0625W; Manufacturer Part Number: R0402_560R_1%_0.0625W_100PPM; Case: 0402; Mounted: Yes; Sense: No; Socket: No; SMD: Yes; Manufacturer1 Example: YAGEO PHYCOMP; Manufacturer1 ComponentHeight: 0.4mm; HelpURL: \\cern.ch\dfs\Applications\Altium\Datasheets\R0402_Phycomp_RC0402.pdf; Author: CERN DEM JLC; CreateDate: 03.12.2007; LatestRevisionDate: 17.10.2012
SW1 = CMP-1458-00004-1: WS-TATU THT Tact Switch 6X6 mm right angle type with ground terminal; Manufacturer: Wuerth Elektronik; NoPins: 04; PackageReference: 431256038716; ComponentLink2URL: http://katalog.we-online.de/em/datasheet/43125603x.pdf; ComponentLink2Description: Datasheet; ComponentLink1URL: http://www.we-online.com; ComponentLink1Description: Manufacturer URL; PartNumber: 431256038716
U14 = CMP-0859-00130-4: as U7 on sheet RTC_TEMP; Max Operating Temperature: 125°C; Number of Inputs: 1; Lead Free: Lead Free; Max Supply Voltage: 5.5V; Packaging: Tape and Reel; RoHS Compliant: Yes; Number of Pins: 5; Number of Input Lines: 1; Number of Outputs: 1; Technology: CMOS; Number of Bits: 1; Number of Gates: 1; Case/Package: SOT-23-5; Propagation Delay: 9.8ns; Series: 74LVC; Number of Elements: 1; Package Quantity: 3000; Number of Bits per Element: 1; Mount: Surface Mount; Number of Output Lines: 1; Min Operating Temperature: -40°C

## Nets that join several sheets
GND: CM4_Home_Controller (J9.2), CM4 (52 pins), M.2_NVME (24 pins), Power (65 pins), Ethernet (10 pins), USB (32 pins), HDMI_DP (9 pins), RTC_TEMP (10 pins), ZIGBEE (18 pins), Misc (SW1.1 SW1.2 SW1.4 U14.3)
P3V3: CM4_Home_Controller (J9.4), CM4 (CM1.78), M.2_NVME (IC1.6 Y2.1 Y2.4), Power (12 pins), Ethernet (R2.1 R3.1), USB (14 pins), RTC_TEMP (C26.2 D5.1 R27.2 U11.5), ZIGBEE (11 pins), Misc (D6.2 D7.2 U14.5)
P5V0: CM4 (6 pins), Power (12 pins), USB (C25.2 U19.4), HDMI_DP (U13.1), RTC_TEMP (C50.2 R4.2 R20.2 U7.5)
32k768: M.2_NVME (J1.68 R24.2), RTC_TEMP (R21.2)
ACT: CM4 (CM1.19), Ethernet (J2.17)
CM4_RST: CM4 (CM1.92), Misc (R26.2 R28.2)
GLOBAL_EN: CM4 (CM1.99), RTC_TEMP (U7.4)
HDMI_CEC: CM4 (CM1.151), HDMI_DP (IC2.1 J4.13)
HDMI_CLK_N: CM4 (CM1.190), HDMI_DP (IC2.9 J4.12)
HDMI_CLK_P: CM4 (CM1.188), HDMI_DP (IC2.10 J4.10)
HDMI_D0_N: CM4 (CM1.184), HDMI_DP (IC2.11 J4.9)
HDMI_D0_P: CM4 (CM1.182), HDMI_DP (IC2.12 J4.7)
HDMI_D1_N: CM4 (CM1.178), HDMI_DP (IC2.13 J4.6)
HDMI_D1_P: CM4 (CM1.176), HDMI_DP (IC2.14 J4.4)
HDMI_D2_N: CM4 (CM1.172), HDMI_DP (IC2.15 J4.3)
HDMI_D2_P: CM4 (CM1.170), HDMI_DP (IC2.16 J4.1)
HDMI_HOTPLUG: CM4 (CM1.153), HDMI_DP (IC2.4 J4.19)
HDMI_SCL: CM4 (CM1.200), HDMI_DP (IC2.2 J4.15)
HDMI_SDA: CM4 (CM1.199), HDMI_DP (IC2.3 J4.16)
LED_nPWR: CM4 (CM1.95), Misc (U14.2)
LINK: CM4 (CM1.17), Ethernet (J2.19)
MDI0_N: CM4 (CM1.10), Ethernet (J2.10 U1.2 U1.9)
MDI0_P: CM4 (CM1.12), Ethernet (J2.11 U1.1 U1.10)
MDI1_N: CM4 (CM1.6), Ethernet (J2.5 U1.4 U1.7)
MDI1_P: CM4 (CM1.4), Ethernet (J2.4 U1.5 U1.6)
MDI2_N: CM4 (CM1.9), Ethernet (J2.2 U2.4 U2.7)
MDI2_P: CM4 (CM1.11), Ethernet (J2.3 U2.5 U2.6)
MDI3_N: CM4 (CM1.5), Ethernet (J2.9 U2.1 U2.10)
MDI3_P: CM4 (CM1.3), Ethernet (J2.8 U2.2 U2.9)
NetCM1_28: CM4_Home_Controller (J9.10), CM4 (CM1.28)
NetCM1_31: CM4_Home_Controller (J9.12), CM4 (CM1.31)
NetCM1_35: CM4_Home_Controller (J9.3), CM4 (CM1.35)
NetCM1_36: CM4_Home_Controller (J9.1), CM4 (CM1.36)
NetCM1_37: CM4_Home_Controller (J9.9), CM4 (CM1.37)
NetCM1_38: CM4_Home_Controller (J9.14), CM4 (CM1.38)
NetCM1_39: CM4_Home_Controller (J9.11), CM4 (CM1.39)
NetCM1_40: CM4_Home_Controller (J9.13), CM4 (CM1.40)
NetCM1_51: CM4_Home_Controller (J9.6), CM4 (CM1.51)
NetCM1_55: CM4_Home_Controller (J9.8), CM4 (CM1.55)
NetCM1_56: CM4_Home_Controller (J9.7), CM4 (CM1.56)
NetCM1_58: CM4_Home_Controller (J9.5), CM4 (CM1.58)
NetD3#2_3: Power (D4#1.1 L2.1), Ethernet (D3#2.3 D4#2.3)
NetD3#2_4: Power (D4#1.2 L4.1), Ethernet (D3#2.4 D4#2.4)
nEXTRST: CM4 (CM1.100), USB (U3.26)
nLED_ACT: CM4 (CM1.21), Misc (R22.1)
PCIE_CLK_N: CM4 (CM1.112), M.2_NVME (J1.55)
PCIE_CLK_P: CM4 (CM1.110), M.2_NVME (J1.53)
PCIE_CLKREQ: CM4 (CM1.102), M.2_NVME (J1.52)
PCIE_RST: CM4 (CM1.109), M.2_NVME (J1.50)
PCIE_RX0_N: CM4 (CM1.118), M.2_NVME (J1.41)
PCIE_RX0_P: CM4 (CM1.116), M.2_NVME (J1.43)
PCIE_TX0_N: CM4 (CM1.124), M.2_NVME (J1.47)
PCIE_TX0_P: CM4 (CM1.122), M.2_NVME (J1.49)
SCL: CM4 (CM1.80), RTC_TEMP (U8.6 U11.4)
SDA: CM4 (CM1.82), RTC_TEMP (U8.5 U11.1)
USB3_N: USB (U3.6), ZIGBEE (U12.5)
USB3_P: USB (U3.7), ZIGBEE (U12.4)
USB_SEL: CM4 (CM1.101), USB (R14.1 R25.2 U10.1)
USBUS_N: CM4 (CM1.103), USB (U10.6)
USBUS_P: CM4 (CM1.105), USB (U10.4)